# EAGLE schematic DMG Motherboard (EAGLE 5.11)
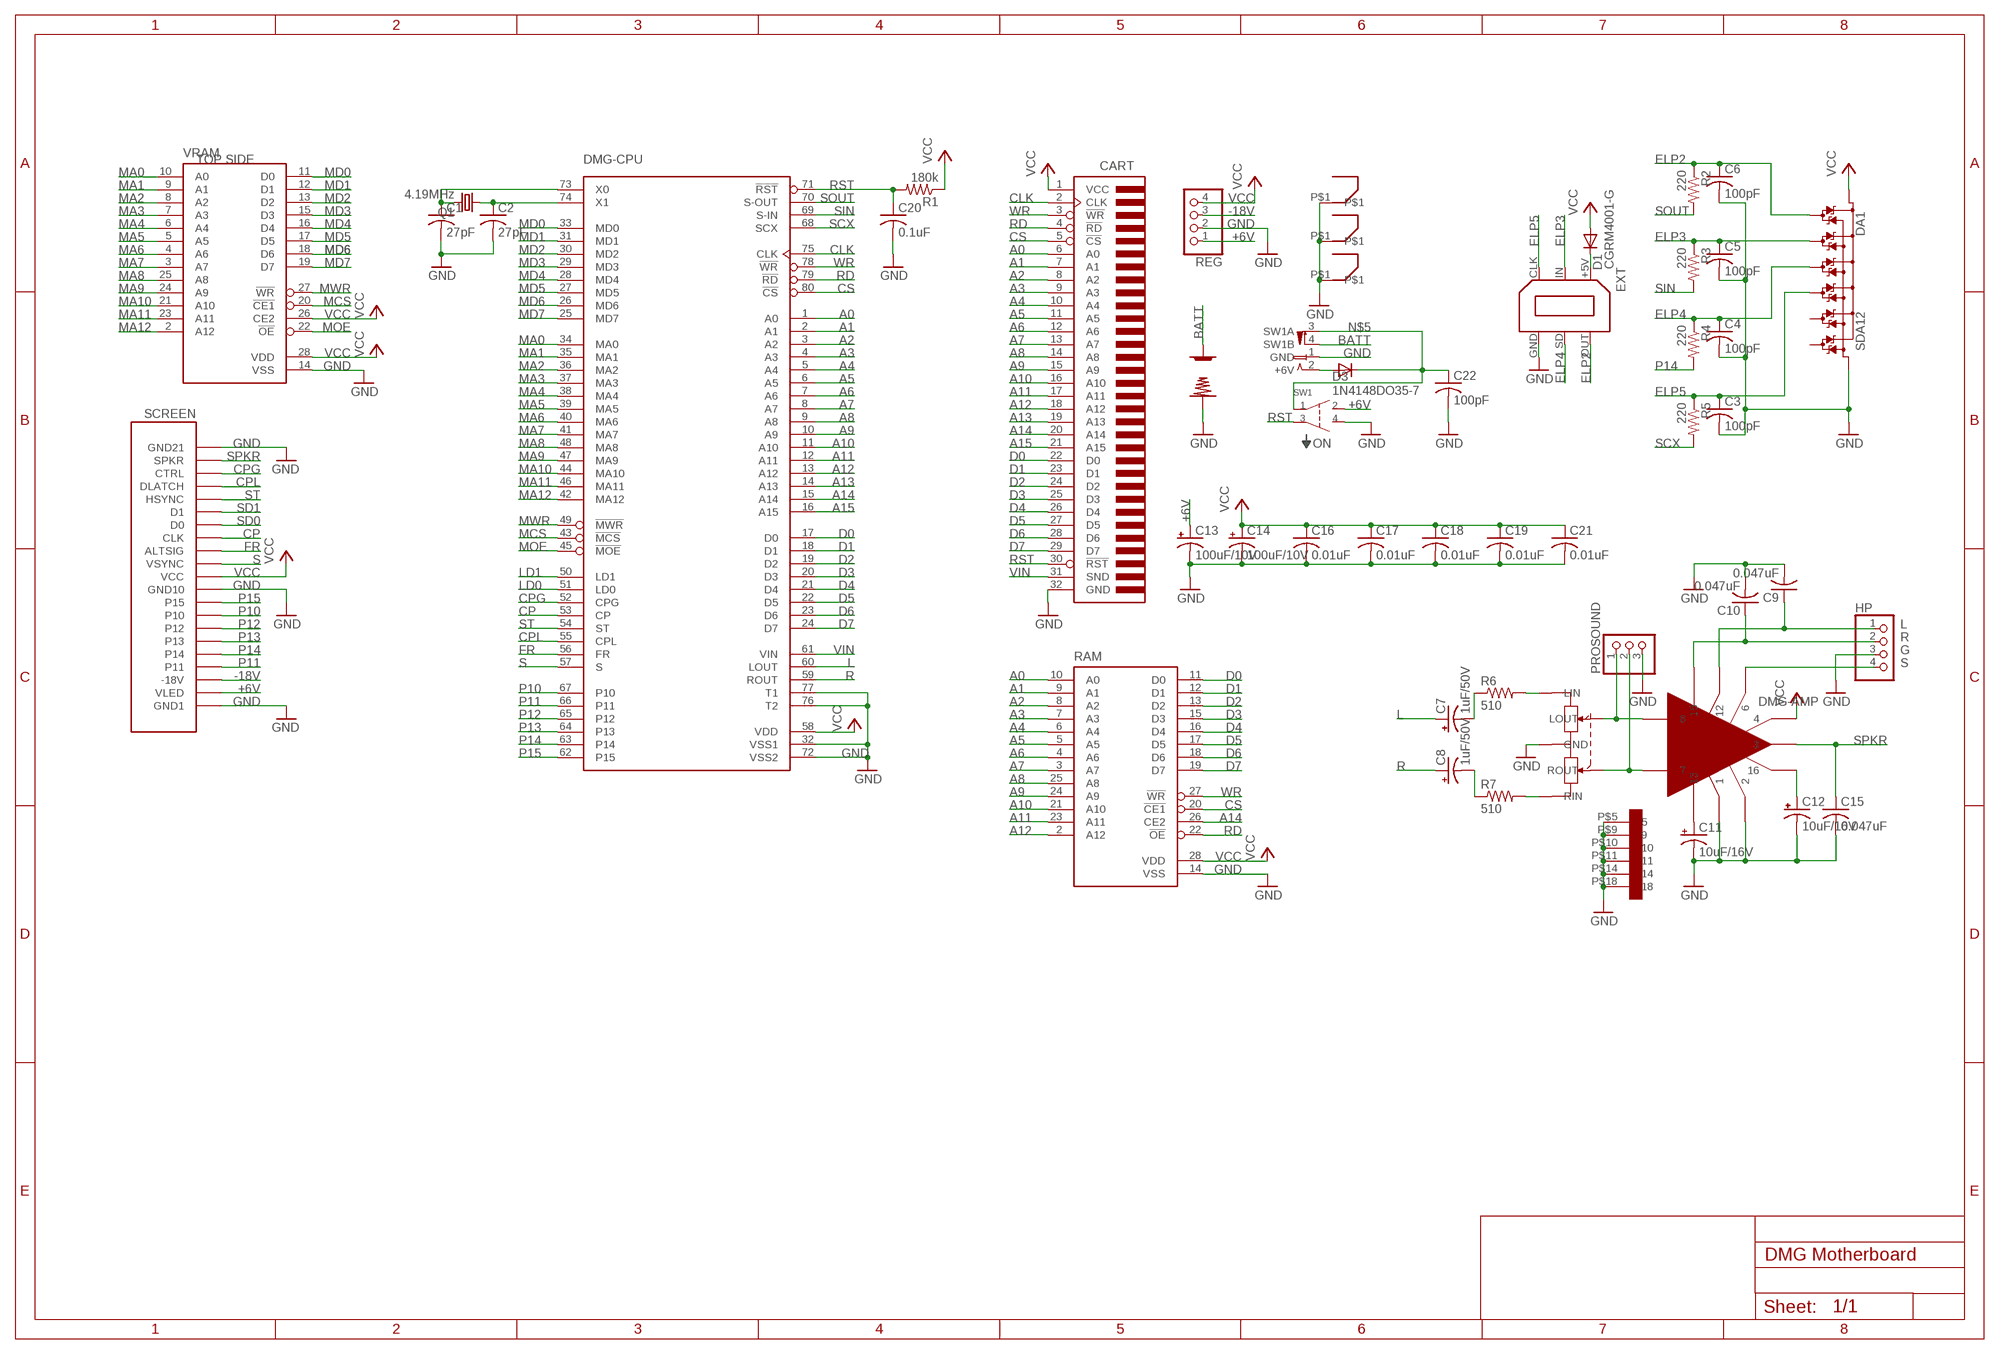
[diagram p0: schematic, sheet 1]

## Parts
+  DMG+BATTERY  [DMG+BATTERY]
-  DMG-BATTERY  [DMG-BATTERY]
C1  27pF  C0603  [R0603]
C2  27pF  C0603  [R0603]
C3  100pF  C0603  [R0603]
C4  100pF  C0603  [R0603]
C5  100pF  C0603  [R0603]
C6  100pF  C0603  [R0603]
C7  1uF/50V  C1206  [C1206]
C8  1uF/50V  C1206  [C1206]
C9  0.047uF  C0603  [R0603]
C10  0.047uF  C0603  [R0603]
C11  10uF/16V  C1206  [C1206]
C12  10uF/16V  C1206  [C1206]
C13  100uF/10V  C1206  [C1206]
C14  100uF/10V  C1206  [C1206]
C15  0.047uF  C0603  [R0603]
C16  0.01uF  C0603  [R0603]
C17  0.01uF  C0603  [R0603]
C18  0.01uF  C0603  [R0603]
C19  0.01uF  C0603  [R0603]
C20  0.1uF  C0603  [R0603]
C21  0.01uF  C0603  [R0603]
C22  100pF  C0603  [R0603]
CART  GBCONN  [GBCONN]
D1  CGRM4001-G  [SOD-123_MINI-SMA]
D3  1N4148DO35-7  [DO35-7]
DA1  SDA12  [SO8]
DMG-AMP  DMG-AMP  [DMG-AMP]
DMG-CPU  DMG-CPU  [DMG-CPU]
EXT  LINKPORTDMG-LINK-SHORT  LINKPORTDMG-LINK  [DMG-LINK]
HP  PINHD-1X4OCT  [1X04OCT]
PROSOUND  PINHD-1X3OCT  [1X03OCT]
PWRJACK  DMG-PWRJACK  [DMG-PWRJACK]
Q1  4.19MHz  CRYSTALHC49S  [HC49/S]
R1  180k  R0603  [R0603]
R2  220  R0603  [R0603]
R3  220  R0603  [R0603]
R4  220  R0603  [R0603]
R5  220  R0603  [R0603]
R6  510  R0603  [R0603]
R7  510  R0603  [R0603]
RAM  LH5264  [SO28]
REG  PINHD-1X4OCT  [1X04OCT]
SCREEN  DMG-SCREEN  DMG-SCREENCONNECTOR  [DMG-SCREEN]
SW1  DMG-SW  [DMG-SWITCH]
U$1  DMG-CONTACT  [DMG-CONTACT]
U$2  DMG-CONTACT  [DMG-CONTACT]
U$3  DMG-CONTACT  [DMG-CONTACT]
VR1  10K  DMG-POT  [DMG-POT]
VRAM  LH5264  [SO28]

## Nets
+6V: C13.+ REG.1 SCREEN.P$2(VLED) SW1.P$2
-18V: REG.3 SCREEN.P$3(-18V)
A0: CART.6(A0) DMG-CPU.1(A0) RAM.10(A0)
A1: CART.7(A1) DMG-CPU.2(A1) RAM.9(A1)
A2: CART.8(A2) DMG-CPU.3(A2) RAM.8(A2)
A3: CART.9(A3) DMG-CPU.4(A3) RAM.7(A3)
A4: CART.10(A4) DMG-CPU.5(A4) RAM.6(A4)
A5: CART.11(A5) DMG-CPU.6(A5) RAM.5(A5)
A6: CART.12(A6) DMG-CPU.7(A6) RAM.4(A6)
A7: CART.13(A7) DMG-CPU.8(A7) RAM.3(A7)
A8: CART.14(A8) DMG-CPU.9(A8) RAM.25(A8)
A9: CART.15(A9) DMG-CPU.10(A9) RAM.24(A9)
A10: CART.16(A10) DMG-CPU.11(A10) RAM.21(A10)
A11: CART.17(A11) DMG-CPU.12(A11) RAM.23(A11)
A12: CART.18(A12) DMG-CPU.13(A12) RAM.2(A12)
A13: CART.19(A13) DMG-CPU.14(A13)
A14: CART.20(A14) DMG-CPU.15(A14) RAM.26(CE2)
A15: CART.21(A15) DMG-CPU.16(A15)
BATT: +.P$1 PWRJACK.4(SW1B)
CLK: CART.2(CLK) DMG-CPU.75(CLK)
CP: DMG-CPU.53(CP) SCREEN.P$14(CLK)
CPG: DMG-CPU.52(CPG) SCREEN.P$19(CTRL)
CPL: DMG-CPU.55(CPL) SCREEN.P$18(DLATCH)
CS: CART.5(!CS) DMG-CPU.80(!CS) RAM.20(!CE1)
D0: CART.22(D0) DMG-CPU.17(D0) RAM.11(D0)
D1: CART.23(D1) DMG-CPU.18(D1) RAM.12(D1)
D2: CART.24(D2) DMG-CPU.19(D2) RAM.13(D2)
D3: CART.25(D3) DMG-CPU.20(D3) RAM.15(D3)
D4: CART.26(D4) DMG-CPU.21(D4) RAM.16(D4)
D5: CART.27(D5) DMG-CPU.22(D5) RAM.17(D5)
D6: CART.28(D6) DMG-CPU.23(D6) RAM.18(D6)
D7: CART.29(D7) DMG-CPU.24(D7) RAM.19(D7)
ELP2: C6.1 DA1.2(D01) EXT.OUT R2.1
ELP3: C5.1 DA1.3(D02) EXT.IN R3.1
ELP4: C4.1 DA1.4(D03) EXT.SD R4.1
ELP5: C3.1 DA1.6(D04) EXT.CLK R5.1
FR: DMG-CPU.56(FR) SCREEN.P$13(ALTSIG)
GND: -.P$1 C1.2 C2.2 C3.2 C4.2 C5.2 C6.2 C9.2 C10.2 C11.- C12.- C13.- C14.- C15.2 C16.2 C17.2 C18.2 C19.2 C20.2 C21.2 C22.2 CART.32(GND) DA1.5(V-) DMG-AMP.P$1 DMG-AMP.P$2 DMG-AMP.P$5 DMG-AMP.P$9 DMG-AMP.P$10 DMG-AMP.P$11 DMG-AMP.P$14 DMG-AMP.P$18 DMG-CPU.32(VSS1) DMG-CPU.72(VSS2) DMG-CPU.76(T2) DMG-CPU.77(T1) EXT.GND HP.3 PROSOUND.3 PWRJACK.1(GND) RAM.14(VSS) REG.2 SCREEN.P$1(GND1) SCREEN.P$10(GND10) SCREEN.P$21(GND21) SW1.P$4 U$1.P$1 U$2.P$1 U$3.P$1 VR1.P$1(GND) VRAM.14(VSS)
L: C7.+ DMG-CPU.60(LOUT)
LD0: DMG-CPU.51(LD0)
LD1: DMG-CPU.50(LD1)
MA0: DMG-CPU.34(MA0) VRAM.10(A0)
MA1: DMG-CPU.35(MA1) VRAM.9(A1)
MA2: DMG-CPU.36(MA2) VRAM.8(A2)
MA3: DMG-CPU.37(MA3) VRAM.7(A3)
MA4: DMG-CPU.38(MA4) VRAM.6(A4)
MA5: DMG-CPU.39(MA5) VRAM.5(A5)
MA6: DMG-CPU.40(MA6) VRAM.4(A6)
MA7: DMG-CPU.41(MA7) VRAM.3(A7)
MA8: DMG-CPU.48(MA8) VRAM.25(A8)
MA9: DMG-CPU.47(MA9) VRAM.24(A9)
MA10: DMG-CPU.44(MA10) VRAM.21(A10)
MA11: DMG-CPU.46(MA11) VRAM.23(A11)
MA12: DMG-CPU.42(MA12) VRAM.2(A12)
MCS: DMG-CPU.43(!MCS) VRAM.20(!CE1)
MD0: DMG-CPU.33(MD0) VRAM.11(D0)
MD1: DMG-CPU.31(MD1) VRAM.12(D1)
MD2: DMG-CPU.30(MD2) VRAM.13(D2)
MD3: DMG-CPU.29(MD3) VRAM.15(D3)
MD4: DMG-CPU.28(MD4) VRAM.16(D4)
MD5: DMG-CPU.27(MD5) VRAM.17(D5)
MD6: DMG-CPU.26(MD6) VRAM.18(D6)
MD7: DMG-CPU.25(MD7) VRAM.19(D7)
MOE: DMG-CPU.45(!MOE) VRAM.22(!OE)
MWR: DMG-CPU.49(!MWR) VRAM.27(!WR)
N$1: C11.+ DMG-AMP.P$13
N$2: C12.+ DMG-AMP.P$16
N$3: D3.A PWRJACK.2(+6V)
N$5: C22.1 D3.C PWRJACK.3(SW1A) SW1.P$1
N$17: D1.C EXT.+5V
N$18: C10.1 DMG-AMP.P$15 HP.2
N$19: R6.2 VR1.P$4(LIN)
N$20: R7.2 VR1.P$5(RIN)
N$21: C7.- R6.1
N$22: C8.- R7.1
N$23: DMG-AMP.P$8 PROSOUND.1 VR1.P$3(LOUT)
N$24: DMG-AMP.P$7 PROSOUND.2 VR1.P$2(ROUT)
N$26: C9.1 DMG-AMP.P$12 HP.1
N$28: DMG-AMP.P$6 HP.4
P10: DMG-CPU.67(P10) SCREEN.P$8(P10)
P11: DMG-CPU.66(P11) SCREEN.P$4(P11)
P12: DMG-CPU.65(P12) SCREEN.P$7(P12)
P13: DMG-CPU.64(P13) SCREEN.P$6(P13)
P14: DMG-CPU.63(P14) R4.2 SCREEN.P$5(P14)
P15: DMG-CPU.62(P15) SCREEN.P$9(P15)
R: C8.+ DMG-CPU.59(ROUT)
RD: CART.4(!RD) DMG-CPU.79(!RD) RAM.22(!OE)
RST: C20.1 CART.30(!RST) DMG-CPU.71(!RST) R1.2 SW1.P$3
S: DMG-CPU.57(S) SCREEN.P$12(VSYNC)
SCX: DMG-CPU.68(SCX) R5.2
SD0: SCREEN.P$15(D0)
SD1: SCREEN.P$16(D1)
SIN: DMG-CPU.69(S-IN) R3.2
SOUT: DMG-CPU.70(S-OUT) R2.2
SPKR: C15.1 DMG-AMP.P$3 SCREEN.P$20(SPKR)
ST: DMG-CPU.54(ST) SCREEN.P$17(HSYNC)
VCC: C14.+ C16.1 C17.1 C18.1 C19.1 C21.1 CART.1(VCC) D1.A DA1.1(V+) DMG-AMP.P$4 DMG-CPU.58(VDD) R1.1 RAM.28(VDD) REG.4 SCREEN.P$11(VCC) VRAM.26(CE2) VRAM.28(VDD)
VIN: CART.31(SND) DMG-CPU.61(VIN)
WR: CART.3(!WR) DMG-CPU.78(!WR) RAM.27(!WR)
X0: C1.1 DMG-CPU.73(X0) Q1.2
X1: C2.1 DMG-CPU.74(X1) Q1.1
Unconnected: DA1.7(D05) DA1.8(D06)

## Notes on the sheet
- TOP SIDE
- L
- R
- G
- S

## Library data of the parts
+ = Game Boy:DMG+BATTERY
- = Game Boy:DMG-BATTERY
C1-C6 C9 C10 C15-C22 = Game Boy:C0603
C7 C8 C11-C14 = Game Boy:C1206
CART = GameboyDev:GBCONN
D1 = diode:CGRM400*-G: Molded plasitc,JEDEC SOD-123/Mini SMA Source: Comchip CGRM4001-G.pdf
D3 = diode:1N4148: DIODE high speed (Philips)
DA1 = zetex:SDA12: DIODE ARRAY
DMG-AMP = Game Boy:DMG-AMP
DMG-CPU = Game Boy:DMG-CPU
EXT = Game Boy:LINKPORT
HP REG = pinhead:PINHD-1X4: PIN HEADER
PROSOUND = header:PINHD-1X3: PIN HEADER
PWRJACK = Game Boy:DMG-PWRJACK
Q1 = crystal:CRYSTAL: CRYSTAL
R1-R7 = Game Boy:R0603
RAM VRAM = Game Boy:LH5264
SCREEN = Game Boy:DMG-SCREEN: The white connector for the ribbon cable to connect the DMG's front half
SW1 = Game Boy:DMG-SW: DMG Power Switch Pins 1 and 2 are only connected when the power is ON, pins 3 and 4 are only connected when the power is OFF.
U$1-U$3 = Game Boy:DMG-CONTACT
VR1 = Game Boy:DMG-POT